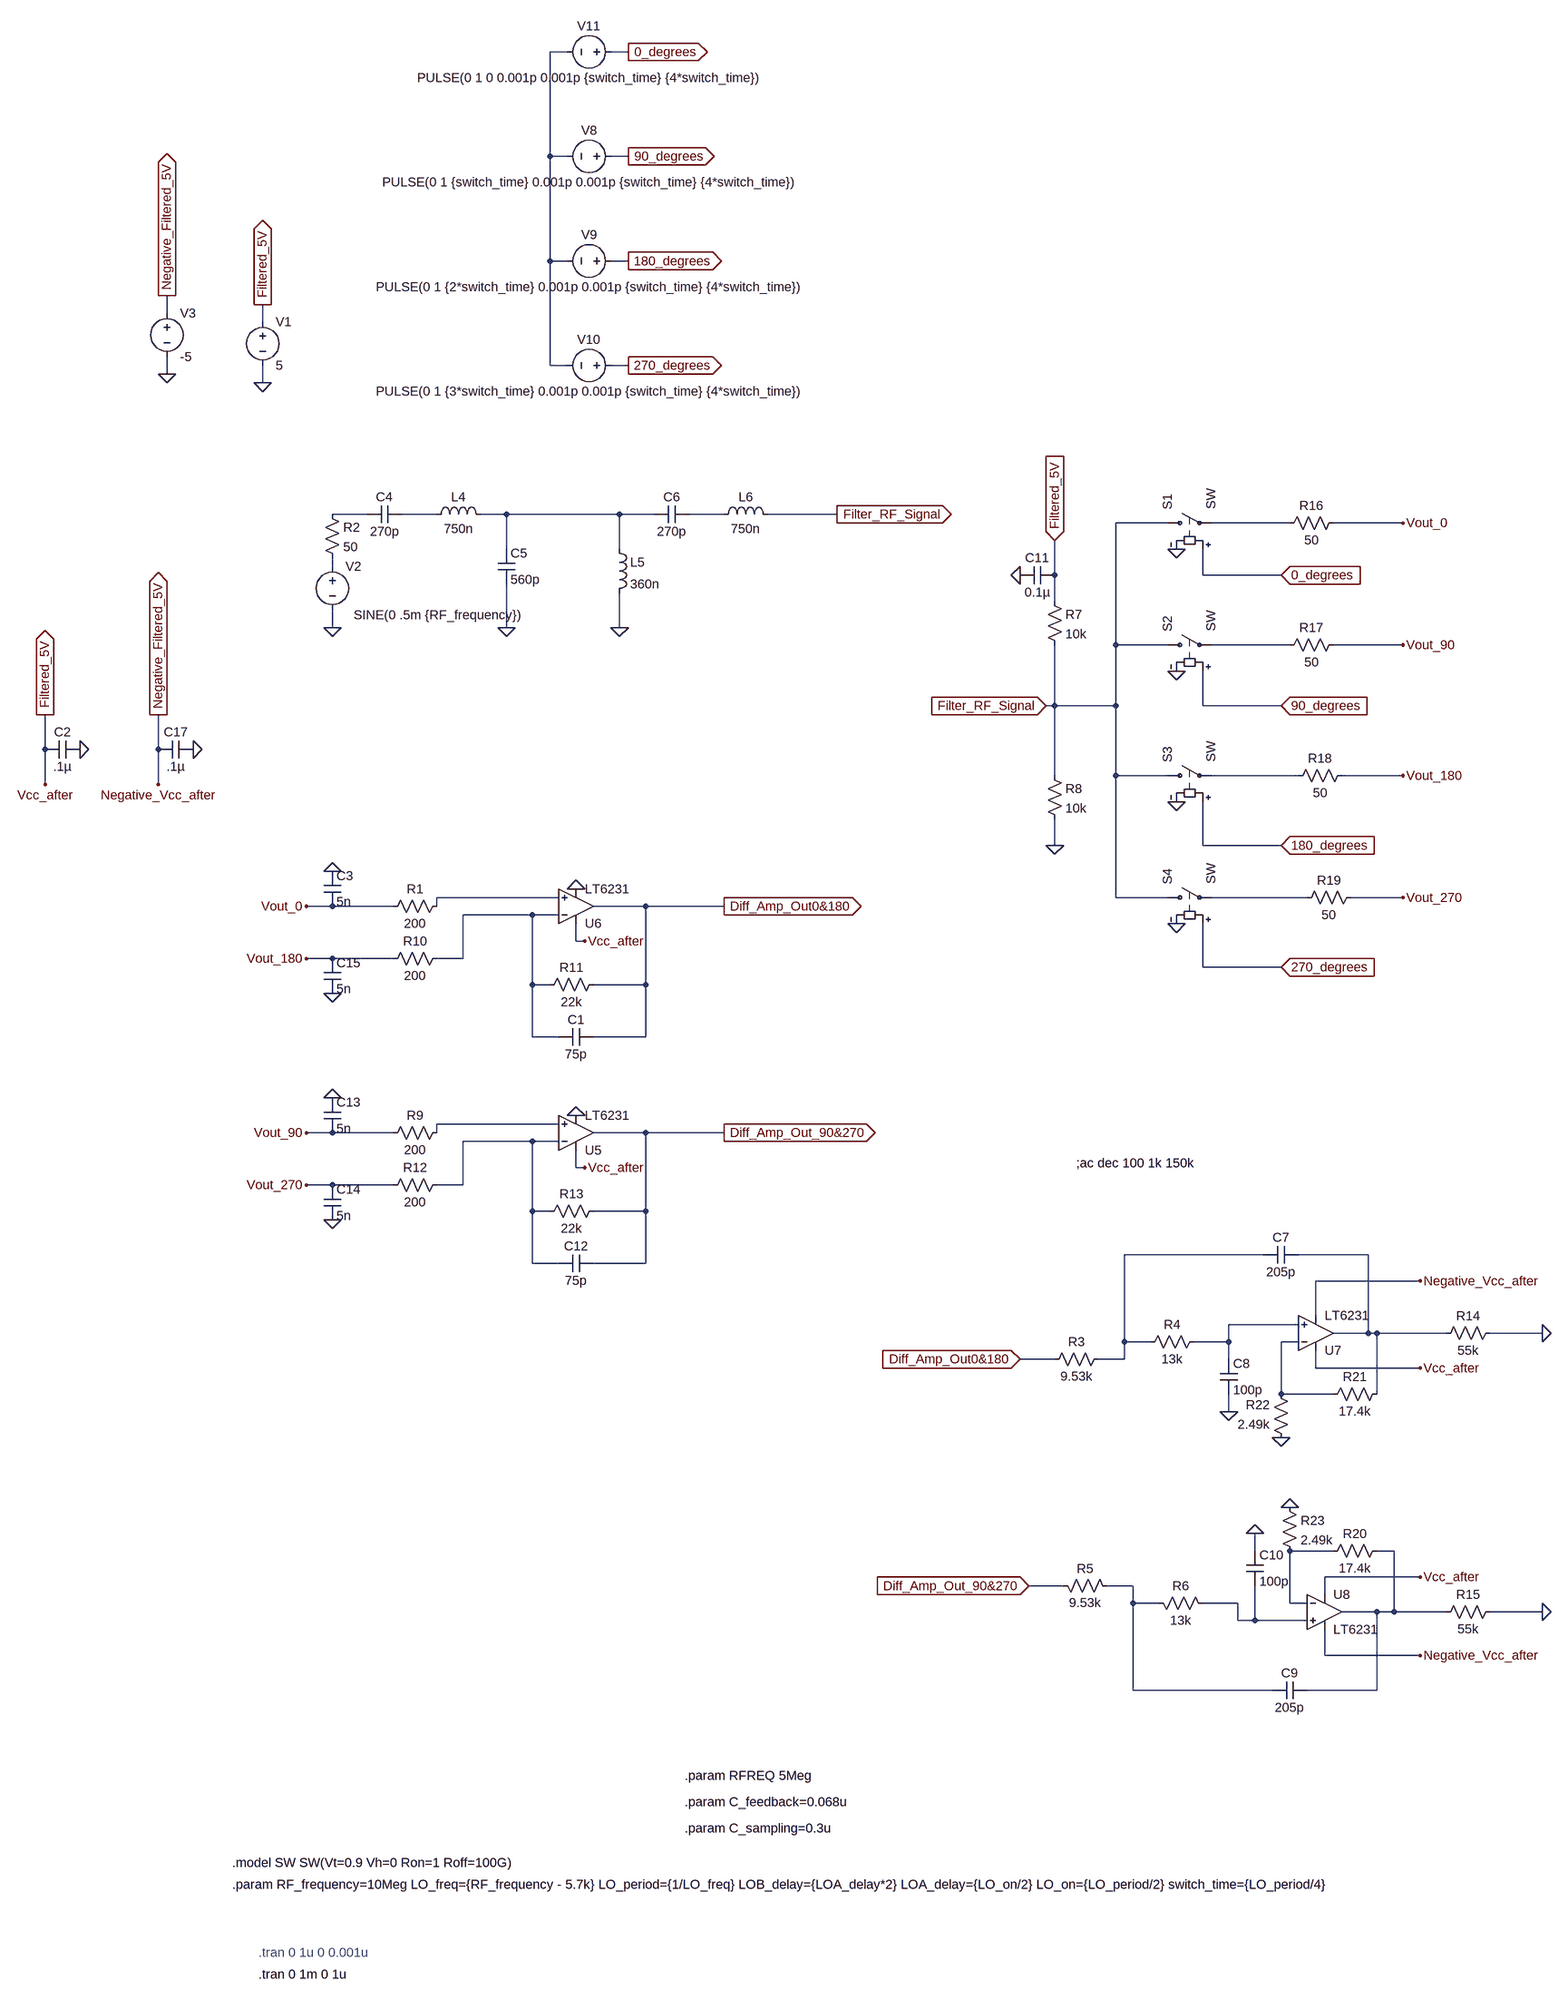
[diagram p0: schematic Complete Sim v5.asc]
Complete Sim v5.asc, the LTspice schematic file:
Version 4
SHEET 1 1960 680
WIRE -928 -3424 -960 -3424
WIRE -816 -3424 -848 -3424
WIRE -960 -3232 -960 -3424
WIRE -928 -3232 -960 -3232
WIRE -816 -3232 -848 -3232
WIRE -960 -3040 -960 -3232
WIRE -928 -3040 -960 -3040
WIRE -816 -3040 -848 -3040
WIRE -1664 -2944 -1664 -2976
WIRE -1488 -2928 -1488 -2960
WIRE -960 -2848 -960 -3040
WIRE -928 -2848 -960 -2848
WIRE -816 -2848 -848 -2848
WIRE -1664 -2832 -1664 -2864
WIRE -1488 -2816 -1488 -2848
WIRE -1296 -2528 -1360 -2528
WIRE -1168 -2528 -1232 -2528
WIRE -1040 -2528 -1088 -2528
WIRE -832 -2528 -1040 -2528
WIRE -768 -2528 -832 -2528
WIRE -640 -2528 -704 -2528
WIRE -432 -2528 -560 -2528
WIRE 176 -2512 80 -2512
WIRE 400 -2512 256 -2512
WIRE 608 -2512 480 -2512
WIRE -1040 -2464 -1040 -2528
WIRE -832 -2464 -832 -2528
WIRE -1360 -2432 -1360 -2448
WIRE -32 -2416 -32 -2480
WIRE 240 -2416 240 -2464
WIRE 384 -2416 240 -2416
WIRE -32 -2368 -32 -2416
WIRE -1360 -2320 -1360 -2352
WIRE -1040 -2320 -1040 -2400
WIRE -832 -2320 -832 -2384
WIRE 80 -2288 80 -2512
WIRE 176 -2288 80 -2288
WIRE 400 -2288 256 -2288
WIRE 608 -2288 480 -2288
WIRE -32 -2176 -32 -2288
WIRE -32 -2176 -48 -2176
WIRE 80 -2176 80 -2288
WIRE 80 -2176 -32 -2176
WIRE 240 -2176 240 -2240
WIRE 384 -2176 240 -2176
WIRE -1888 -2096 -1888 -2160
WIRE -1680 -2096 -1680 -2160
WIRE -32 -2048 -32 -2176
WIRE 80 -2048 80 -2176
WIRE 176 -2048 80 -2048
WIRE 416 -2048 256 -2048
WIRE 608 -2048 496 -2048
WIRE -1888 -2032 -1888 -2096
WIRE -1680 -2032 -1680 -2096
WIRE -32 -1920 -32 -1968
WIRE 240 -1920 240 -2000
WIRE 384 -1920 240 -1920
WIRE -944 -1824 -1168 -1824
WIRE 80 -1824 80 -2048
WIRE 176 -1824 80 -1824
WIRE 432 -1824 256 -1824
WIRE 608 -1824 512 -1824
WIRE -1360 -1808 -1408 -1808
WIRE -1248 -1808 -1360 -1808
WIRE -1168 -1808 -1168 -1824
WIRE -784 -1808 -880 -1808
WIRE -640 -1808 -784 -1808
WIRE -992 -1792 -1120 -1792
WIRE -944 -1792 -992 -1792
WIRE -912 -1744 -912 -1776
WIRE -896 -1744 -912 -1744
WIRE -1360 -1712 -1408 -1712
WIRE -1248 -1712 -1360 -1712
WIRE -1120 -1712 -1120 -1792
WIRE -1120 -1712 -1168 -1712
WIRE 240 -1696 240 -1776
WIRE 384 -1696 240 -1696
WIRE -992 -1664 -992 -1792
WIRE -960 -1664 -992 -1664
WIRE -784 -1664 -784 -1808
WIRE -784 -1664 -880 -1664
WIRE -992 -1568 -992 -1664
WIRE -944 -1568 -992 -1568
WIRE -784 -1568 -784 -1664
WIRE -784 -1568 -880 -1568
WIRE -944 -1408 -1168 -1408
WIRE -1360 -1392 -1408 -1392
WIRE -1248 -1392 -1360 -1392
WIRE -1168 -1392 -1168 -1408
WIRE -784 -1392 -880 -1392
WIRE -640 -1392 -784 -1392
WIRE -992 -1376 -1120 -1376
WIRE -944 -1376 -992 -1376
WIRE -912 -1328 -912 -1360
WIRE -896 -1328 -912 -1328
WIRE -1360 -1296 -1408 -1296
WIRE -1248 -1296 -1360 -1296
WIRE -1120 -1296 -1120 -1376
WIRE -1120 -1296 -1168 -1296
WIRE -992 -1248 -992 -1376
WIRE -960 -1248 -992 -1248
WIRE -784 -1248 -784 -1392
WIRE -784 -1248 -880 -1248
WIRE 352 -1168 96 -1168
WIRE 544 -1168 416 -1168
WIRE -992 -1152 -992 -1248
WIRE -944 -1152 -992 -1152
WIRE -784 -1152 -784 -1248
WIRE -784 -1152 -880 -1152
WIRE 640 -1120 448 -1120
WIRE 448 -1056 448 -1120
WIRE 416 -1040 288 -1040
WIRE 544 -1024 544 -1168
WIRE 544 -1024 480 -1024
WIRE 560 -1024 544 -1024
WIRE 688 -1024 560 -1024
WIRE 864 -1024 768 -1024
WIRE 96 -1008 96 -1168
WIRE 144 -1008 96 -1008
WIRE 288 -1008 288 -1040
WIRE 288 -1008 224 -1008
WIRE 416 -1008 384 -1008
WIRE -32 -976 -96 -976
WIRE 96 -976 96 -1008
WIRE 96 -976 48 -976
WIRE 288 -976 288 -1008
WIRE 448 -960 448 -992
WIRE 640 -960 448 -960
WIRE 384 -912 384 -1008
WIRE 480 -912 384 -912
WIRE 560 -912 560 -1024
WIRE 288 -880 288 -912
WIRE 336 -624 336 -656
WIRE 480 -624 400 -624
WIRE 592 -624 560 -624
WIRE 640 -576 464 -576
WIRE -16 -560 -80 -560
WIRE 112 -560 64 -560
WIRE 464 -544 464 -576
WIRE 112 -528 112 -560
WIRE 160 -528 112 -528
WIRE 304 -528 240 -528
WIRE 400 -528 400 -624
WIRE 432 -528 400 -528
WIRE 560 -512 496 -512
WIRE 592 -512 592 -624
WIRE 592 -512 560 -512
WIRE 688 -512 592 -512
WIRE 864 -512 768 -512
WIRE 304 -496 304 -528
WIRE 336 -496 336 -560
WIRE 336 -496 304 -496
WIRE 432 -496 336 -496
WIRE 464 -432 464 -480
WIRE 640 -432 464 -432
WIRE 112 -368 112 -528
WIRE 368 -368 112 -368
WIRE 560 -368 560 -512
WIRE 560 -368 432 -368
FLAG -1040 -2320 0
FLAG 288 -880 0
FLAG 336 -656 0
FLAG -1824 -2096 0
FLAG -912 -1840 0
FLAG -1360 -1872 0
FLAG -1360 -1648 0
FLAG -432 -2528 Filter_RF_Signal
IOPIN -432 -2528 Out
FLAG 192 -2464 0
FLAG 192 -2240 0
FLAG 192 -2000 0
FLAG 192 -1776 0
FLAG -48 -2176 Filter_RF_Signal
IOPIN -48 -2176 In
FLAG -96 -2416 0
FLAG -32 -1920 0
FLAG -1488 -2816 0
FLAG -1488 -2960 Filtered_5V
IOPIN -1488 -2960 Out
FLAG -32 -2480 Filtered_5V
IOPIN -32 -2480 In
FLAG -816 -3424 0_degrees
IOPIN -816 -3424 Out
FLAG -816 -3232 90_degrees
IOPIN -816 -3232 Out
FLAG -816 -3040 180_degrees
IOPIN -816 -3040 Out
FLAG -816 -2848 270_degrees
IOPIN -816 -2848 Out
FLAG 384 -2416 0_degrees
IOPIN 384 -2416 In
FLAG 384 -2176 90_degrees
IOPIN 384 -2176 In
FLAG 384 -1920 180_degrees
IOPIN 384 -1920 In
FLAG 384 -1696 270_degrees
IOPIN 384 -1696 In
FLAG -1888 -2032 Vcc_after
FLAG -912 -1424 0
FLAG -1360 -1456 0
FLAG -1360 -1232 0
FLAG 608 -2512 Vout_0
FLAG -1408 -1808 Vout_0
FLAG 608 -2288 Vout_90
FLAG -1408 -1392 Vout_90
FLAG 608 -2048 Vout_180
FLAG -1408 -1712 Vout_180
FLAG 608 -1824 Vout_270
FLAG -1408 -1296 Vout_270
FLAG -1888 -2160 Filtered_5V
IOPIN -1888 -2160 Out
FLAG -896 -1744 Vcc_after
FLAG -896 -1328 Vcc_after
FLAG 640 -960 Vcc_after
FLAG 640 -576 Vcc_after
FLAG -640 -1392 Diff_Amp_Out_90&270
IOPIN -640 -1392 Out
FLAG -80 -560 Diff_Amp_Out_90&270
IOPIN -80 -560 In
FLAG -640 -1808 Diff_Amp_Out0&180
IOPIN -640 -1808 Out
FLAG -96 -976 Diff_Amp_Out0&180
IOPIN -96 -976 In
FLAG 864 -1024 0
FLAG 864 -512 0
FLAG -1360 -2320 0
FLAG 384 -832 0
FLAG 400 -704 0
FLAG -1664 -2832 0
FLAG -1664 -2976 Negative_Filtered_5V
IOPIN -1664 -2976 Out
FLAG -832 -2320 0
FLAG -1616 -2096 0
FLAG -1680 -2032 Negative_Vcc_after
FLAG -1680 -2160 Negative_Filtered_5V
IOPIN -1680 -2160 Out
FLAG 640 -1120 Negative_Vcc_after
FLAG 640 -432 Negative_Vcc_after
SYMBOL voltage -1360 -2448 R0
WINDOW 123 40 48 Left 2
WINDOW 39 39 77 Left 2
WINDOW 3 39 105 Left 2
SYMATTR Value SINE(0 .5m {RF_frequency})
SYMATTR InstName V2
SYMBOL cap -1296 -2512 R270
WINDOW 0 32 32 VTop 2
WINDOW 3 0 32 VBottom 2
SYMATTR InstName C4
SYMATTR Value 270p
SYMBOL ind -1184 -2512 R270
WINDOW 0 32 56 VTop 2
WINDOW 3 5 56 VBottom 2
SYMATTR InstName L4
SYMATTR Value 750n
SYMBOL cap -1056 -2464 R0
SYMATTR InstName C5
SYMATTR Value 560p
SYMBOL ind -848 -2480 R0
SYMATTR InstName L5
SYMATTR Value 360n
SYMBOL cap -768 -2512 R270
WINDOW 0 32 32 VTop 2
WINDOW 3 0 32 VBottom 2
SYMATTR InstName C6
SYMATTR Value 270p
SYMBOL ind -656 -2512 R270
WINDOW 0 32 56 VTop 2
WINDOW 3 5 56 VBottom 2
SYMATTR InstName L6
SYMATTR Value 750n
SYMBOL res -1376 -2544 R0
SYMATTR InstName R2
SYMATTR Value 50
SYMBOL res 64 -992 R90
WINDOW 0 0 56 VBottom 2
WINDOW 3 32 56 VTop 2
SYMATTR InstName R3
SYMATTR Value 9.53k
SYMBOL res 240 -1024 R90
WINDOW 0 0 56 VBottom 2
WINDOW 3 32 56 VTop 2
SYMATTR InstName R4
SYMATTR Value 13k
SYMBOL cap 416 -1184 R90
WINDOW 0 0 32 VBottom 2
WINDOW 3 32 32 VTop 2
SYMATTR InstName C7
SYMATTR Value 205p
SYMBOL cap 272 -976 R0
SYMATTR InstName C8
SYMATTR Value 100p
SYMBOL res 80 -544 M270
WINDOW 0 32 56 VTop 2
WINDOW 3 0 56 VBottom 2
SYMATTR InstName R5
SYMATTR Value 9.53k
SYMBOL res 256 -512 M270
WINDOW 0 32 56 VTop 2
WINDOW 3 0 56 VBottom 2
SYMATTR InstName R6
SYMATTR Value 13k
SYMBOL cap 432 -352 M270
WINDOW 0 32 32 VTop 2
WINDOW 3 0 32 VBottom 2
SYMATTR InstName C9
SYMATTR Value 205p
SYMBOL cap 320 -560 M180
WINDOW 0 24 56 Left 2
WINDOW 3 24 8 Left 2
SYMATTR InstName C10
SYMATTR Value 100p
SYMBOL sw 160 -2512 R270
SYMATTR InstName S1
SYMBOL sw 160 -2288 R270
SYMATTR InstName S2
SYMBOL sw 160 -2048 R270
SYMATTR InstName S3
SYMBOL sw 160 -1824 R270
SYMATTR InstName S4
SYMBOL res -1152 -1824 R90
WINDOW 0 0 56 VBottom 2
WINDOW 3 32 56 VTop 2
SYMATTR InstName R1
SYMATTR Value 200
SYMBOL res -1152 -1728 R90
WINDOW 0 0 56 VBottom 2
WINDOW 3 32 56 VTop 2
SYMATTR InstName R10
SYMATTR Value 200
SYMBOL res -864 -1680 R90
WINDOW 0 0 56 VBottom 2
WINDOW 3 32 56 VTop 2
SYMATTR InstName R11
SYMATTR Value 22k
SYMBOL cap -1824 -2112 R90
WINDOW 0 0 32 VBottom 2
WINDOW 3 32 32 VTop 2
SYMATTR InstName C2
SYMATTR Value .1µ
SYMBOL cap -1376 -1872 R0
SYMATTR InstName C3
SYMATTR Value 5n
SYMBOL cap -1376 -1712 R0
SYMATTR InstName C15
SYMATTR Value 5n
SYMBOL res -48 -2384 R0
SYMATTR InstName R7
SYMATTR Value 10k
SYMBOL res -48 -2064 R0
SYMATTR InstName R8
SYMATTR Value 10k
SYMBOL cap -32 -2432 R90
WINDOW 0 0 32 VBottom 2
WINDOW 3 32 32 VTop 2
SYMATTR InstName C11
SYMATTR Value 0.1µ
SYMBOL voltage -1488 -2944 R0
WINDOW 123 0 0 Left 0
WINDOW 39 0 0 Left 0
SYMATTR InstName V1
SYMATTR Value 5
SYMBOL voltage -832 -3232 R90
WINDOW 0 -32 56 VBottom 2
WINDOW 3 32 56 VTop 2
WINDOW 123 0 0 Left 0
WINDOW 39 0 0 Left 0
SYMATTR InstName V8
SYMATTR Value PULSE(0 1 {switch_time} 0.001p 0.001p {switch_time} {4*switch_time})
SYMBOL voltage -832 -3040 R90
WINDOW 0 -32 56 VBottom 2
WINDOW 3 32 56 VTop 2
WINDOW 123 0 0 Left 0
WINDOW 39 0 0 Left 0
SYMATTR InstName V9
SYMATTR Value PULSE(0 1 {2*switch_time} 0.001p 0.001p {switch_time} {4*switch_time})
SYMBOL voltage -832 -2848 R90
WINDOW 0 -32 56 VBottom 2
WINDOW 3 32 56 VTop 2
WINDOW 123 0 0 Left 0
WINDOW 39 0 0 Left 0
SYMATTR InstName V10
SYMATTR Value PULSE(0 1 {3*switch_time} 0.001p 0.001p {switch_time} {4*switch_time})
SYMBOL res -1152 -1408 R90
WINDOW 0 0 56 VBottom 2
WINDOW 3 32 56 VTop 2
SYMATTR InstName R9
SYMATTR Value 200
SYMBOL res -1152 -1312 R90
WINDOW 0 0 56 VBottom 2
WINDOW 3 32 56 VTop 2
SYMATTR InstName R12
SYMATTR Value 200
SYMBOL res -864 -1264 R90
WINDOW 0 0 56 VBottom 2
WINDOW 3 32 56 VTop 2
SYMATTR InstName R13
SYMATTR Value 22k
SYMBOL cap -1376 -1456 R0
SYMATTR InstName C13
SYMATTR Value 5n
SYMBOL cap -1376 -1296 R0
SYMATTR InstName C14
SYMATTR Value 5n
SYMBOL voltage -832 -3424 R90
WINDOW 0 -32 56 VBottom 2
WINDOW 3 32 56 VTop 2
WINDOW 123 0 0 Left 0
WINDOW 39 0 0 Left 0
SYMATTR InstName V11
SYMATTR Value PULSE(0 1 0 0.001p 0.001p {switch_time} {4*switch_time})
SYMBOL OpAmps\\LT6231 -912 -1392 M180
SYMATTR InstName U5
SYMBOL OpAmps\\LT6231 -912 -1808 M180
SYMATTR InstName U6
SYMBOL OpAmps\\LT6231 448 -1024 M180
SYMATTR InstName U7
SYMBOL OpAmps\\LT6231 464 -512 R0
SYMATTR InstName U8
SYMBOL res 496 -2528 R90
WINDOW 0 0 56 VBottom 2
WINDOW 3 32 56 VTop 2
SYMATTR InstName R16
SYMATTR Value 50
SYMBOL res 496 -2304 R90
WINDOW 0 0 56 VBottom 2
WINDOW 3 32 56 VTop 2
SYMATTR InstName R17
SYMATTR Value 50
SYMBOL res 512 -2064 R90
WINDOW 0 0 56 VBottom 2
WINDOW 3 32 56 VTop 2
SYMATTR InstName R18
SYMATTR Value 50
SYMBOL res 528 -1840 R90
WINDOW 0 0 56 VBottom 2
WINDOW 3 32 56 VTop 2
SYMATTR InstName R19
SYMATTR Value 50
SYMBOL res 784 -1040 R90
WINDOW 0 0 56 VBottom 2
WINDOW 3 32 56 VTop 2
SYMATTR InstName R14
SYMATTR Value 55k
SYMBOL res 784 -528 R90
WINDOW 0 0 56 VBottom 2
WINDOW 3 32 56 VTop 2
SYMATTR InstName R15
SYMATTR Value 55k
SYMBOL cap -880 -1584 R90
WINDOW 0 0 32 VBottom 2
WINDOW 3 32 32 VTop 2
SYMATTR InstName C1
SYMATTR Value 75p
SYMBOL cap -880 -1168 R90
WINDOW 0 0 32 VBottom 2
WINDOW 3 32 32 VTop 2
SYMATTR InstName C12
SYMATTR Value 75p
SYMBOL res 576 -640 R90
WINDOW 0 0 56 VBottom 2
WINDOW 3 32 56 VTop 2
SYMATTR InstName R20
SYMATTR Value 17.4k
SYMBOL res 576 -928 R90
WINDOW 0 0 56 VBottom 2
WINDOW 3 32 56 VTop 2
SYMATTR InstName R21
SYMATTR Value 17.4k
SYMBOL res 400 -816 R180
WINDOW 0 36 76 Left 2
WINDOW 3 36 40 Left 2
SYMATTR InstName R22
SYMATTR Value 2.49k
SYMBOL res 384 -720 R0
SYMATTR InstName R23
SYMATTR Value 2.49k
SYMBOL voltage -1664 -2960 R0
WINDOW 123 0 0 Left 0
WINDOW 39 0 0 Left 0
SYMATTR InstName V3
SYMATTR Value -5
SYMBOL cap -1616 -2112 R90
WINDOW 0 0 32 VBottom 2
WINDOW 3 32 32 VTop 2
SYMATTR InstName C17
SYMATTR Value .1µ
TEXT 8 -1336 Left 2 !;ac dec 100 1k 150k
TEXT -1544 -16 Left 2 !.model SW SW(Vt=0.9 Vh=0 Ron=1 Roff=100G)
TEXT -712 -176 Left 2 !.param RFREQ 5Meg
TEXT -1544 24 Left 2 !.param RF_frequency=10Meg LO_freq={RF_frequency - 5.7k} LO_period={1/LO_freq} LOB_delay={LOA_delay*2} LOA_delay={LO_on/2} LO_on={LO_period/2} switch_time={LO_period/4}
TEXT -712 -128 Left 2 !.param C_feedback=0.068u
TEXT -712 -80 Left 2 !.param C_sampling=0.3u
TEXT -1496 520 Left 2 !.tran 0 1m 0 1u
TEXT -1496 480 Left 2 ;.tran 0 1u 0 0.001u

The netlist it stands for:
* Complete Sim v5.asc
V2 N007 0 SINE(0 .5m {RF_frequency})
C4 N002 N003 270p
L4 N003 N004 750n
C5 N004 0 560p
L5 N004 0 360n
C6 N004 N005 270p
L6 N005 Filter_RF_Signal 750n
R2 N002 N007 50
R3 N015 Diff_Amp_Out0&180 9.53k
R4 N017 N015 13k
C7 N016 N015 205p
C8 N017 0 100p
R5 N021 Diff_Amp_Out_90&270 9.53k
R6 N022 N021 13k
C9 N020 N021 205p
C10 N022 0 100p
S1 Filter_RF_Signal N006 0_degrees 0 SW
S2 Filter_RF_Signal N008 90_degrees 0 SW
S3 Filter_RF_Signal N009 180_degrees 0 SW
S4 Filter_RF_Signal N011 270_degrees 0 SW
R1 N010 Vout_0 200
R10 N012 Vout_180 200
R11 Diff_Amp_Out0&180 N012 22k
C2 0 Vcc_after .1µ
C3 0 Vout_0 5n
C15 Vout_180 0 5n
R7 Vcc_after Filter_RF_Signal 10k
R8 Filter_RF_Signal 0 10k
C11 Vcc_after 0 0.1µ
V1 Vcc_after 0 5
V8 90_degrees N001 PULSE(0 1 {switch_time} 0.001p 0.001p {switch_time} {4*switch_time})
V9 180_degrees N001 PULSE(0 1 {2*switch_time} 0.001p 0.001p {switch_time} {4*switch_time})
V10 270_degrees N001 PULSE(0 1 {3*switch_time} 0.001p 0.001p {switch_time} {4*switch_time})
R9 N013 Vout_90 200
R12 N014 Vout_270 200
R13 Diff_Amp_Out_90&270 N014 22k
C13 0 Vout_90 5n
C14 Vout_270 0 5n
V11 0_degrees N001 PULSE(0 1 0 0.001p 0.001p {switch_time} {4*switch_time})
XU5 N013 N014 Diff_Amp_Out_90&270 Vcc_after 0 LT6231  ; pins In+ In- OUT V+ V-
XU6 N010 N012 Diff_Amp_Out0&180 Vcc_after 0 LT6231  ; pins In+ In- OUT V+ V-
XU7 N017 N018 N016 Vcc_after Negative_Vcc_after LT6231  ; pins In+ In- OUT V+ V-
XU8 N022 N019 N020 Vcc_after Negative_Vcc_after LT6231  ; pins In+ In- OUT V+ V-
R16 Vout_0 N006 50
R17 Vout_90 N008 50
R18 Vout_180 N009 50
R19 Vout_270 N011 50
R14 0 N016 55k
R15 0 N020 55k
C1 Diff_Amp_Out0&180 N012 75p
C12 Diff_Amp_Out_90&270 N014 75p
R20 N020 N019 17.4k
R21 N016 N018 17.4k
R22 0 N018 2.49k
R23 0 N019 2.49k
V3 Negative_Vcc_after 0 -5
C17 0 Negative_Vcc_after .1µ
;ac dec 100 1k 150k
.model SW SW(Vt=0.9 Vh=0 Ron=1 Roff=100G)
.param RFREQ 5Meg
.param RF_frequency=10Meg LO_freq={RF_frequency - 5.7k} LO_period={1/LO_freq} LOB_delay={LOA_delay*2} LOA_delay={LO_on/2} LO_on={LO_period/2} switch_time={LO_period/4}
.param C_feedback=0.068u
.param C_sampling=0.3u
.tran 0 1m 0 1u
* .tran 0 1u 0 0.001u
.lib LTC2.lib
.backanno
.end